# Altium schematic sheet Power.SchDoc
size A
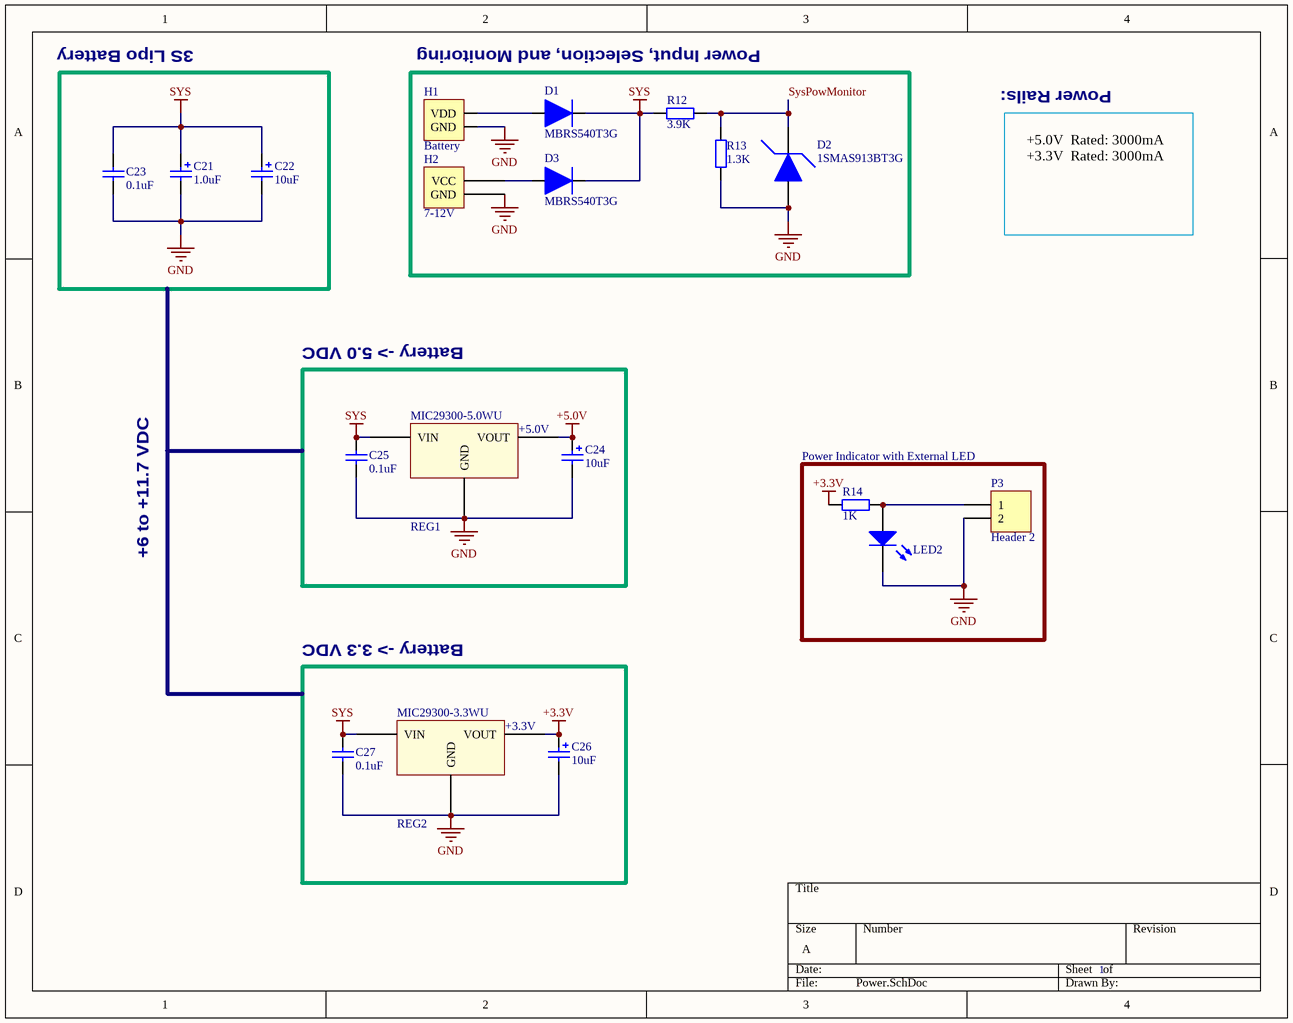
[diagram p0: Power.SchDoc]

## Parts
C21  value 1.0uF  [Capacitor - Tantalum Case A]  (hidden comment: 1.0uF Low-ESR Tantalum CaseA)
C22  value 10uF  [CAPPR2-5x5]  (hidden comment: 10uF Electrolitic)
C23  value 0.1uF  [SMD 1206]  (hidden comment: 0.1uF SMD 1206)
C24  value 10uF  [Capacitor - Tantalum Case A]  (hidden comment: 10uF Low-ESR Tantalum CaseA)
C25  value 0.1uF  [SMD 1206]  (hidden comment: 0.1uF SMD 1206)
C26  value 10uF  [Capacitor - Tantalum Case A]  (hidden comment: 10uF Low-ESR Tantalum CaseA)
C27  value 0.1uF  [SMD 1206]  (hidden comment: 0.1uF SMD 1206)
D1  MBRS540T3G  [MBRS540T3G]
D2  1SMAS913BT3G  [1SMA5913BT3G]
D3  MBRS540T3G  [MBRS540T3G]
H1  Battery  [PC Wire Connector]
H2  7-12V  [DC Power Jack]
LED2  ON  [PLCC-4 LED]  (value not drawn)
P3  Header 2  [HDR1X2]
R12  value 3.9K  [RES12.2-8.5X3.3]  (hidden comment: 3.9K Radial)
R13  value 1.3K  [RES12.2-8.5X3.3]  (hidden comment: 1.3K Radial)
R14  value 1K  [SMD 0805]  (hidden comment: 1K SMD 0805)
REG1  MIC29300-5.0WU  [TO-263 D2PACK]  (value not drawn)
REG2  MIC29300-3.3WU  [TO-263 D2PACK]  (value not drawn)

## Blocks framed on the sheet
Power Indicator with External LED: LED2 P3 R14

## Nets
+3.3V: C26.1(+) R14.1 REG2.2(VOUT)
+5.0V: C24.1(+) REG1.2(VOUT)
GND: C21.2(-) C22.2 C23.1 C24.2(-) C25.2 C26.2(-) C27.1 D2.0(In) H1.R(GND) H2.GND LED2.2(K) P3.2 R13.1 REG1.1(GND) REG2.1(GND)
SYS: C21.1(+) C22.1 C23.2 C25.1 C27.2 D1.1(Out) D3.1(Out) R12.2 REG1.0(VIN) REG2.0(VIN)
SysPowMonitor: D2.1(Out) R12.1 R13.2
NetD1_0: D1.0(In) H1.L(VDD)
NetD3_0: D3.0(In) H2.VCC
NetLED2_1: LED2.1(A) P3.1 R14.2

Not connected (* = marked no-connect by the designer): H2 NC

## Notes on the sheet
- 3S Lipo Battery
- Power Input, Selection, and Monitoring
- Power Rails:
- +5.0V  Rated: 3000mA
  +3.3V  Rated: 3000mA
- Battery -> 5.0 VDC
- +6 to +11.7 VDC
- Battery -> 3.3 VDC
- 1
- (in symbol MIC29300-3.3WU) +3.3V
- (in symbol MIC29300-5.0WU) +5.0V

## Library data of the parts
C21 C24 C26 = SMD_Cap_Tantalum: Tantalum Capacitor - Case A
C22 = Cap Pol1: Polarized Capacitor (Radial); Published: 8-Jun-2000; LatestRevisionDate: 17-Jul-2002; LatestRevisionNote: Re-released for DXP Platform.; PackageReference: RB7.6-15; Publisher: Altium Limited; PackageDescription: Polarized Capacitor (Radial); 2 Leads
C23 C25 C27 = Cap: Capacitor
D1 D3 = MBRS540T3G: 40V 5A Scottky Diode; pin to pad: 0>A 1>K
D2 = 1SMAS913BT3G: 3.3V 1.5W Zener Diode; pin to pad: 0>A 1>K
H1 = PC Wire Connector
H2 = DC Jack: DC Power Jack; pin to pad: GND>OUT VCC>IN
LED2 = SMD LED: Surface Mount Chip LED; pin to pad: 1>2 2>1
P3 = Header 2: Header, 2-Pin; LatestRevisionDate: 17-Jul-2002; LatestRevisionNote: Re-released for DXP Platform.; Publisher: Altium Limited
R12-R14 = Res2: Resistor
REG1 = MIC29300-5.0WU: 3.0A LDO Fixed Volt.(ROHS Compliant); pin to pad: 0>1 1>2 2>3
REG2 = MIC29300-3.3WU: 3.0A LDO Fixed Volt.(ROHS Compliant); pin to pad: 0>1 1>2 2>3